# EasyEDA Pro project esp32-1602.eprj

# Schematic Schematic1
Board Name: Board1; Create Date: 2025-05-10; Page Name: P1; Project Name: thermostat; Schematic Name: Schematic1; Update Date: 2025-05-10; Company: EasyEDA.com; Page Size: A4; Version: V1.0
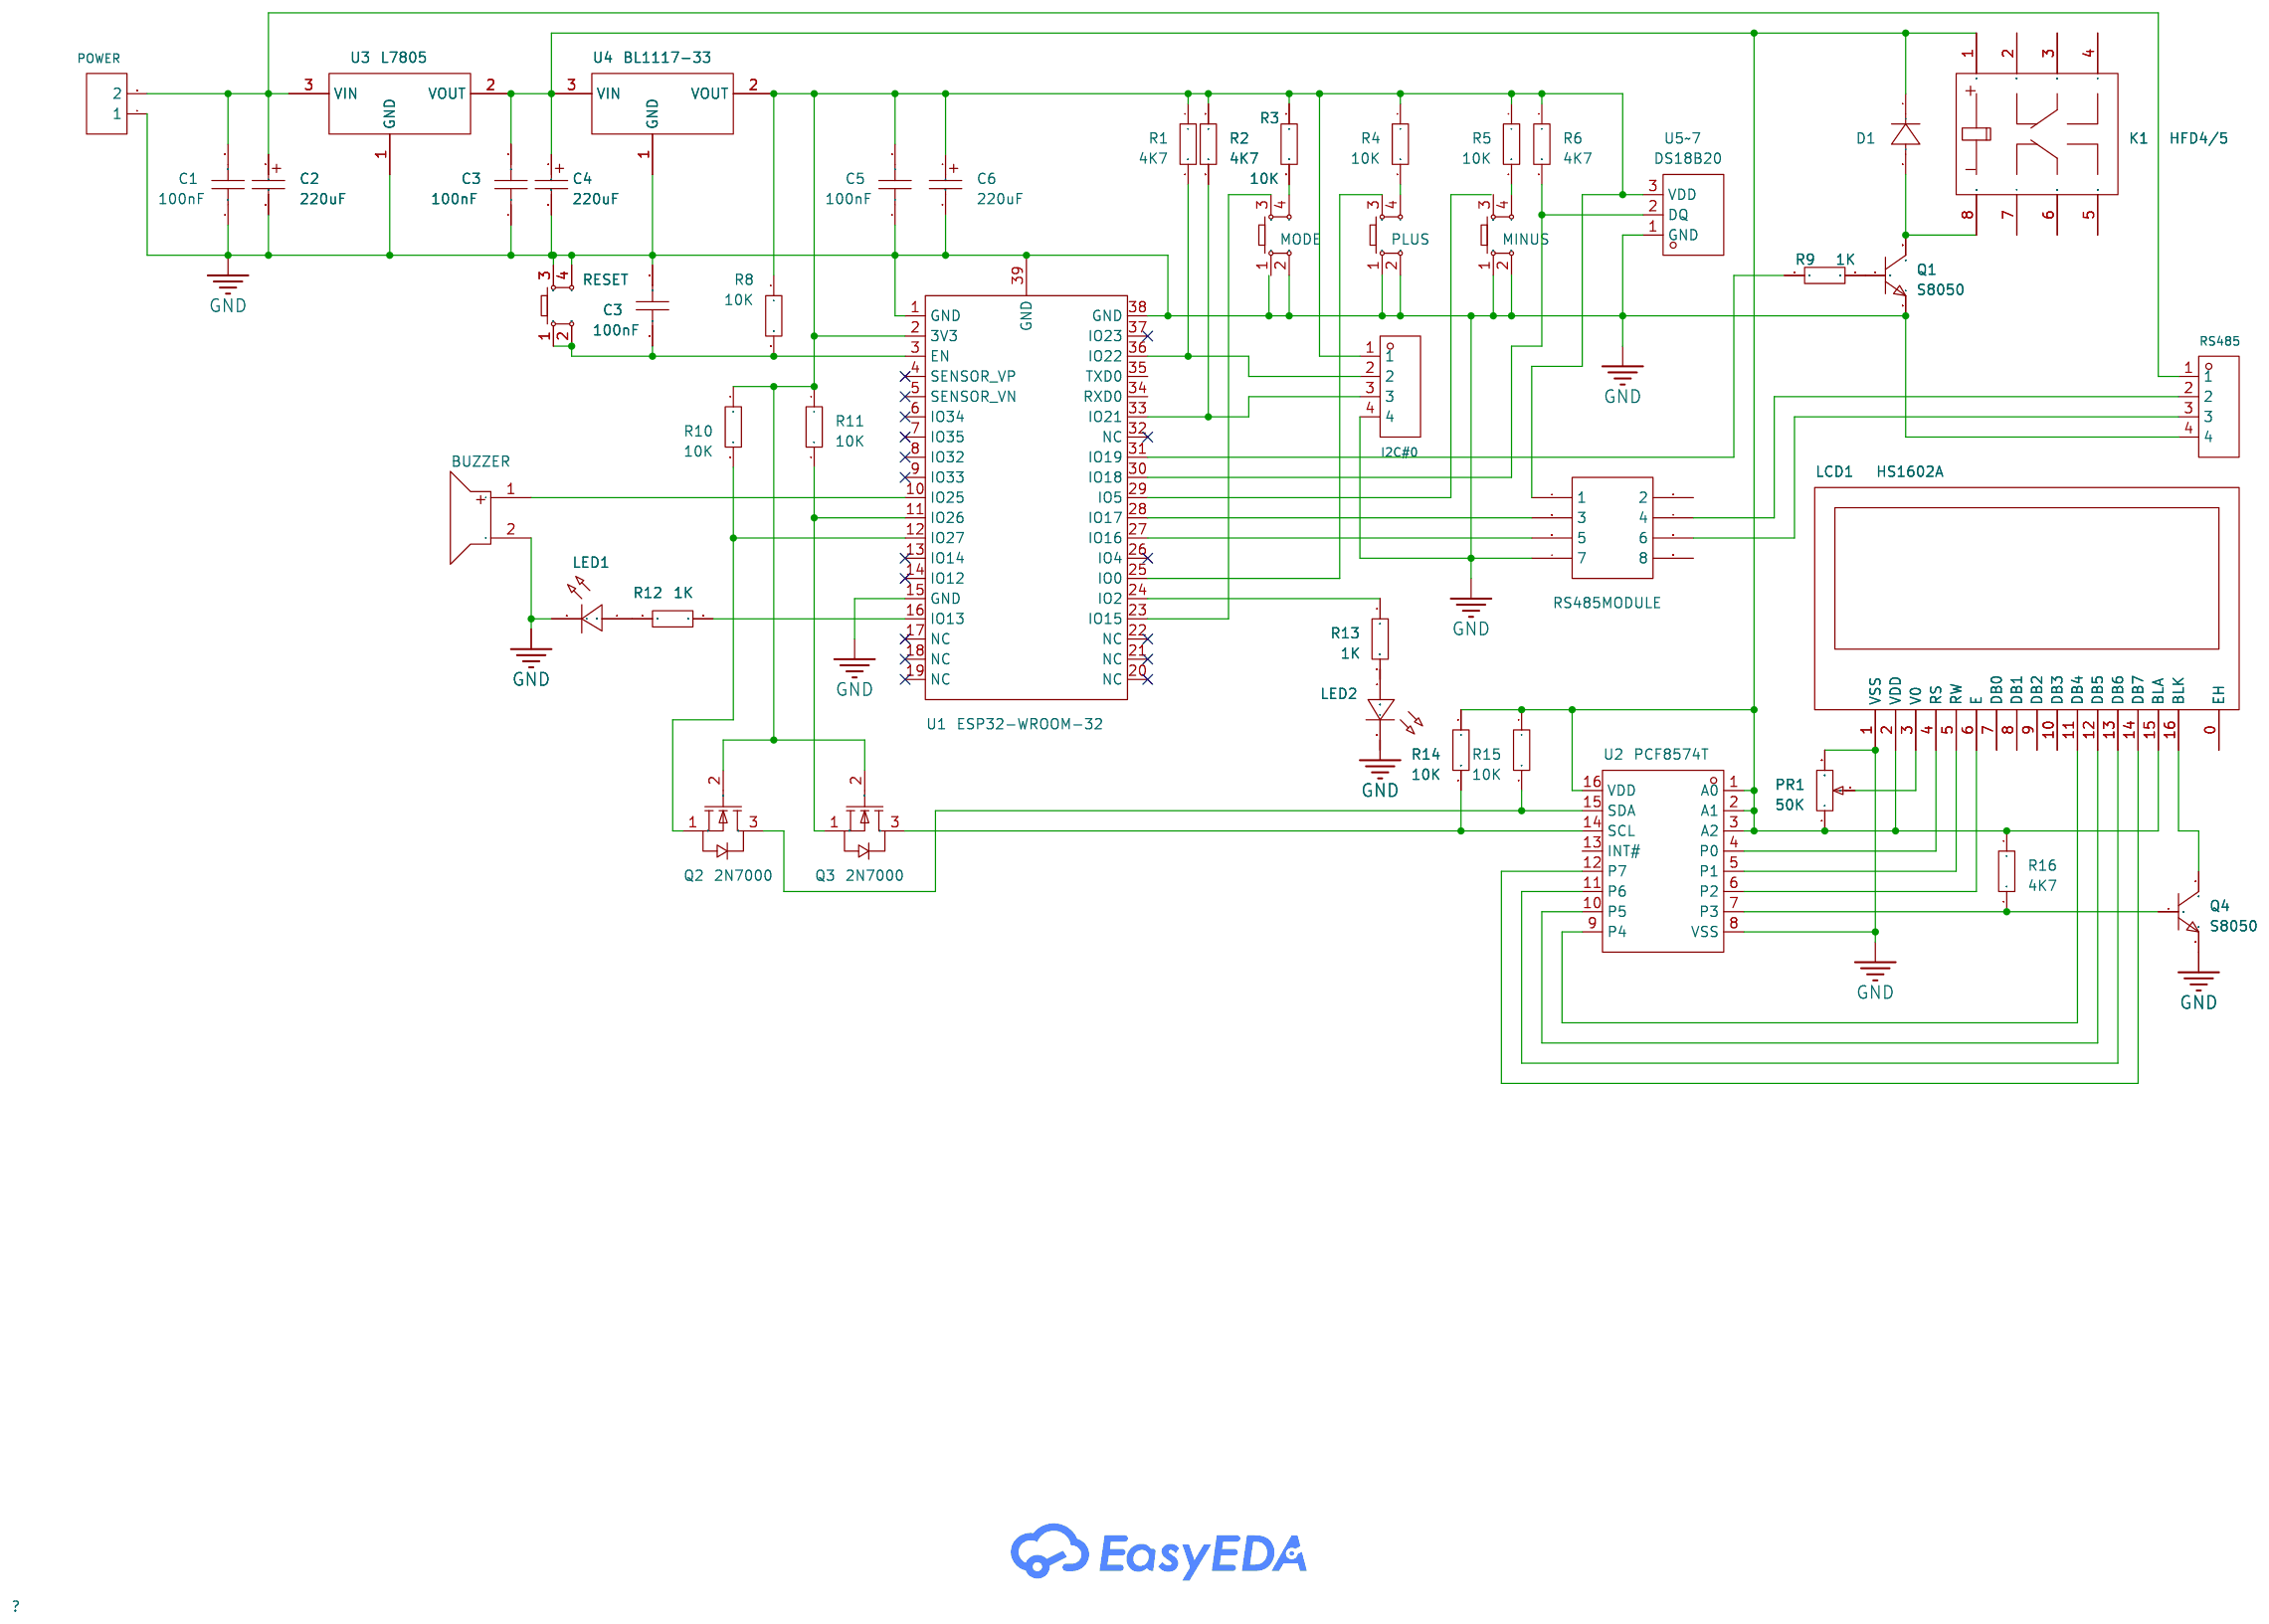
[diagram p0: schematic sheet]

## Parts
BUZZER  2.4kHz  [BUZ-TH_BD12.0-P7.60-D0.6-FD]
C1  100nF  [C0201]
C2  220uF  [CAP-SMD_BD3.0-L3.3-W3.3-RD]
C3  100nF  [C0201]
C3#2  100nF  [C0201]
C4  220uF  [CAP-SMD_BD3.0-L3.3-W3.3-RD]
C5  100nF  [C0201]
C6  220uF  [CAP-SMD_BD3.0-L3.3-W3.3-RD]
D1  -  [DO-41_BD2.4-L4.7-P8.70-D0.9-RD]
I2C#0  -  [HDR-TH_4P-P2.54-V-F]
K1  HFD4/5  [RELAY-TH_HFDXXX]
LCD1  HS1602A  [LCD1602]
LED1  -  [LED-TH_BD3.0-P2.54-FD]
LED2  -  [LED-TH_BD3.0-P2.54-FD]
MINUS  -  [SW-SMD_4P-L6.0-W6.0-P4.50-LS9.0-2]
MODE  -  [SW-SMD_4P-L6.0-W6.0-P4.50-LS9.0-2]
PLUS  -  [SW-SMD_4P-L6.0-W6.0-P4.50-LS9.0-2]
POWER  -  [HDR-TH_2P-P2.54-V-F]
PR1  50K  [RES-ADJ-TH_3P-L9.5-W9.5-P2.54-BR-BS]
Q1  S8050  [SOT-23-3_L2.9-W1.3-P1.90-LS2.4-BR]
Q2  2N7000  [TO-92-3_L4.8-W3.7-P2.54-L]
Q3  2N7000  [TO-92-3_L4.8-W3.7-P2.54-L]
Q4  S8050  [SOT-23-3_L2.9-W1.3-P1.90-LS2.4-BR]
R1  4K7  [R0603]
R2  4K7  [R0603]
R3  10K  [R0603]
R4  10K  [R0603]
R5  10K  [R0603]
R6  4K7  [R0603]
R8  10K  [R0603]
R9  1K  [R0603]
R10  10K  [R0603]
R11  10K  [R0603]
R12  1K  [R0603]
R13  1K  [R0603]
R14  10K  [R0603]
R15  10K  [R0603]
R16  4K7  [R0603]
RESET  -  [SW-SMD_4P-L6.0-W6.0-P4.50-LS9.0-2]
RS485  -  [HDR-TH_4P-P2.54-V-F]
RS485MODULE  -  [HDR-TH_8P-P2.54-V-F-R2-C4-S2.54-1]
U1  ESP32-WROOM-32  [WIFI-SMD_ESP32-WROOM-32E]
U2  PCF8574T  [SOP-16_L10.3-W7.5-P1.27-LS10.4-BL]
U3  L7805  [TO-252-2_L6.6-W6.1-P4.57-LS9.9-TL-CW]
U4  BL1117-33  [TO-252-2_L6.6-W6.1-P4.57-LS9.9-TL-CW]
U5~7  DS18B20  [TO-92-3_L4.5-W3.5-P1.27-L]

## Library data of the parts
BUZZER = TMB12A03: LCSC Part Name: 有源电磁式蜂鸣器; Supplier Part: C781859; Manufacturer: YUEXIN(悦馨); Supplier Footprint: 插件,D=12mm; JLCPCB Part Class: Extended Part; Datasheet: https://atta.szlcsc.com/upload/public/pdf/source/20200927/C781859_CEC7B7F6A9D62F380D126441DF0F265C.pdf; Supplier: LCSC; Driver Circuitry: Active (Built-in Driver Circuit); Technology: Electromagnetic Type; Voltage - Supply: 4V~6V; Current Consumption: 30mA; Sound Pressure Level(SPL): 88dB; Diameter(φD): 12mm; Height: 9.5mm; Operating Temperature: -30℃~+85℃
C1 C3 C3#2 C5 = CAP_0201: Supplier Footprint: 0201
C2 C4 C6 = C_Ele_SMD_3x5.4mm: Supplier Footprint: SMD,3x5.4mm
D1 = 1N4007: Supplier Footprint: DO-41
I2C#0 RS485 = HDR-F_2.54_1x4P: Supplier Footprint: Through
K1 = HFD4/5: LCSC Part Name: 超小型5V继电器 双刀双掷; Supplier Part: C23510; Manufacturer: HF(宏发); Supplier Footprint: DIP,6.5x10mm; JLCPCB Part Class: Extended Part; Datasheet: https://atta.szlcsc.com/upload/public/pdf/source/20190729/C390665_9F7E181D3821B0A9B6A96379D32A4DEC.pdf; Supplier: LCSC; Coil Voltage: 5V; Contact Form: Two Sets of Conversion: 2C (DPDT-Conversion); Number of Pins: 8; Contact Rating: 1A@30VDC；300mA@125VAC; Switching Voltage(Max): 250V@AC；220V@DC; Contact Material: AgNi+Gold plating; Coil Rated Power: 140mW; Coil Resistance: 178Ω; Switching Current(Max): 2A; Operate Time: 3ms; Release Time: 3ms; Coil Type: Polarized - single coil; Contact Resistance: 100mΩ; Operating Temperature: -40℃~+85℃
LCD1 = HS1602A: LCSC Part Name: 2.0寸16*2单色字符字符液晶显示屏; Supplier Part: C5329588; Manufacturer: HS(汉昇); JLCPCB Part Class: Extended Part; Datasheet: https://atta.szlcsc.com/upload/public/pdf/source/20221212/35734F14DBB323F90DD8DBE1717CD9FD.pdf; Supplier: LCSC; Main Control Chip: SPLC780; Size: 2; Operating Temperature: -20℃~+70℃
LED1 LED2 = LED_TH-R_3mm: Supplier Footprint: Through
MINUS MODE PLUS RESET = Key_SMD_6x6x6.5: Supplier Footprint: SMD
POWER = HDR-F_2.54_1x2P: Supplier Footprint: Through
PR1 = R_3386P: Supplier Footprint: Through
Q1 Q4 = S8050_C2846756: LCSC Part Name: NPN 电流:500mA 耐压:25V; Supplier Part: C2846756; Manufacturer: UMW(友台半导体); Supplier Footprint: SOT-23; JLCPCB Part Class: Extended Part; Datasheet: https://atta.szlcsc.com/upload/public/pdf/source/20231109/CC2BCCE3E0BB53E872CD60D7C979DAE8.pdf; Supplier: LCSC; Collector Current (Ic): 500mA; Power Dissipation (Pd): 300mW; DC Current Gain (hFE@Ic,Vce): 120@50mA,1V; Transition Frequency (fT): 150MHz; Collector Cut-Off Current (Icbo): 100nA; Collector-Emitter Saturation Voltage (VCE(sat)@Ic,Ib): 600mV@500mA,50mA; Operating Temperature: -55℃~+150℃
Q2 Q3 = 2N7000-D74Z: LCSC Part Name: 1个N沟道 耐压:60V 电流:200mA; Supplier Part: C900717; Manufacturer: onsemi(安森美); Supplier Footprint: TO-92-3; JLCPCB Part Class: Extended Part; Datasheet: https://atta.szlcsc.com/upload/public/pdf/source/20210809/C900717_E0C96B00CF4E5BF84AE2BACE99F744A0.pdf; Supplier: LCSC; Type: 1 N-channel; Drain Source On Resistance (RDS(on)@Vgs,Id): 1.2Ω@10V,500mA; Gate Threshold Voltage (Vgs(th)@Id): 3V@1mA; Input Capacitance (Ciss@Vds): 50pF@25V; Reverse Transfer Capacitance (Crss@Vds): 5pF@25V; Operating Temperature: -55℃~+150℃
R1-R6 R8-R16 = Res_0603: Supplier Footprint: 0603
RS485MODULE = HDR-F-2.54_2x4: Supplier Footprint: Through
U1 = ESP32-WROOM-32E-N4: LCSC Part Name: 通用型Wi-Fi+BT+BLE MCU模组; Supplier Part: C701341; Manufacturer: ESPRESSIF(乐鑫); Supplier Footprint: SMD,18x25.5mm; JLCPCB Part Class: Extended Part; Datasheet: https://atta.szlcsc.com/upload/public/pdf/source/20220601/0020821B65DE5740BBACA5FACC5CF3B6.pdf; Supplier: LCSC
U2 = PCF8574T_C2832396: LCSC Part Name: 远程8位I2C总线I/O扩展器; Supplier Part: C2832396; Manufacturer: HGSEMI(华冠); Supplier Footprint: SOP-16-300mil; JLCPCB Part Class: Extended Part; Datasheet: https://atta.szlcsc.com/upload/public/pdf/source/20190611/C398075_1925312D8618E19C6137781D5B71A3CA.pdf; Supplier: LCSC; Interface: I2C; Number of I/O: 8; Interrupt Output: With Interrupt Output; Output Type: Leakage; Voltage - Supply: 2.5V~6V; Clock Frequency: 100kHz; Operating Temperature: -40℃~+85℃
U3 U4 = BL1117-33CY: LCSC Part Name: 输入12V 输出3.3V 1A; Supplier Part: C165080; Manufacturer: BL(上海贝岭); Supplier Footprint: TO-252-2(DPAK); JLCPCB Part Class: Extended Part; Datasheet: https://atta.szlcsc.com/upload/public/pdf/source/20180613/C194636_D3864D322BCB225C7C2160CC92E3DB8E.pdf; Supplier: LCSC; Output Type: Fixed; Voltage - Supply: 12V; Output Voltage: 3.3V; Output Current: 1A; Power Supply Rejection Ratio (PSRR): 60dB@(120Hz); Voltage Dropout: 1.5V@(1A); Features: 热关断(TSD)；Overcurrent Protection(OCP); Output Configuration: Positive electrode; Number of Outputs: 1
U5~7 = DS18B20_C5451632: LCSC Part Name: 温度-10℃~70℃ 精度±0.4℃ 电压2.5V~5.5V; Supplier Part: C5451632; Manufacturer: HXY MOSFET(华轩阳电子); Supplier Footprint: TO-92; JLCPCB Part Class: Extended Part; Datasheet: https://atta.szlcsc.com/upload/public/pdf/source/20230427/F43BF9FBC8AD29BCFCC811AFA154CBDD.pdf; Supplier: LCSC; Temperature Range: -10℃~70℃; Tolerance: ±0.4℃; Voltage - Supply: 2.5V~5.5V

## Nets
GND: BUZZER.2 C1.1 C2.2 C3.1 C3#2.2 C4.2 C5.1 C6.2 I2C#0.4 LCD1.1(VSS) LED1.2(A) LED2.2(A) MINUS.1 MINUS.2 MODE.2 PLUS.1 PLUS.2 POWER.1 PR1.3 Q1.2(E) Q4.2(E) RESET.3 RESET.4 RS485.4 RS485MODULE.7 U1.1(GND) U1.15(GND) U1.38(GND) U1.39(GND) U2.8(VSS) U3.1(GND) U4.1(GND) U5~7.1(GND)
Net-(BUZZER-1): BUZZER.1 U1.10(IO25)
Net-(C1-2): C1.2 C2.1 POWER.2 RS485.1 U3.3(VIN)
Net-(C3#2-1): C3#2.1 R8.2 RESET.1 RESET.2 U1.3(EN)
Net-(C3-2): C3.2 C4.1 D1.1(K) K1.1 LCD1.2(VDD) LCD1.15(BLA) PR1.1 R14.1 R15.1 R16.1 U2.1(A0) U2.2(A1) U2.3(A2) U2.16(VDD) U3.2(VOUT) U4.3(VIN)
Net-(C5-2): C5.2 C6.1 I2C#0.1 Q2.2(G) Q3.2(G) R1.1 R2.1 R3.1 R4.1 R5.1 R6.1 R8.1 R10.1 R11.1 RS485MODULE.1 U1.2(3V3) U4.2(VOUT) U5~7.3(VDD)
Net-(D1-2): D1.2(A) K1.8 Q1.3(C)
Net-(I2C#0-2): I2C#0.2 R1.2 U1.36(IO22)
Net-(I2C#0-3): I2C#0.3 R2.2 U1.33(IO21)
Net-(LCD1-3): LCD1.3(V0) PR1.2
Net-(LCD1-4): LCD1.4(RS) U2.4(P0)
Net-(LCD1-5): LCD1.5(RW) U2.5(P1)
Net-(LCD1-6): LCD1.6(E) U2.6(P2)
Net-(LCD1-11): LCD1.11(DB4) U2.9(P4)
Net-(LCD1-12): LCD1.12(DB5) U2.10(P5)
Net-(LCD1-13): LCD1.13(DB6) U2.11(P6)
Net-(LCD1-14): LCD1.14(DB7) U2.12(P7)
Net-(LCD1-16): LCD1.16(BLK) Q4.3(C)
Net-(LED1-1): LED1.1(C) R12.1
Net-(LED2-1): LED2.1(C) R13.2
Net-(MINUS-4): MINUS.4 R5.2
Net-(MODE-3): MODE.3 U1.23(IO15)
Net-(MODE-4): MODE.4 R3.2
Net-(PLUS-3): PLUS.3 U1.25(IO0)
Net-(PLUS-4): PLUS.4 R4.2
Net-(Q1-1): Q1.1(B) R9.2
Net-(Q2-1): Q2.1(S) R10.2 U1.12(IO27)
Net-(Q2-3): Q2.3(D) R15.2 U2.15(SDA)
Net-(Q3-1): Q3.1(S) R11.2 U1.11(IO26)
Net-(Q3-3): Q3.3(D) R14.2 U2.14(SCL)
Net-(Q4-1): Q4.1(B) R16.2 U2.7(P3)
Net-(R6-2): R6.2 U1.30(IO18) U5~7.2(DQ)
Net-(R9-1): R9.1 U1.31(IO19)
Net-(R12-2): R12.2 U1.16(IO13)
Net-(R13-1): R13.1 U1.24(IO2)
Net-(RS485-2): RS485.2 RS485MODULE.4
Net-(RS485-3): RS485.3 RS485MODULE.6
Net-(RS485MODULE-3): RS485MODULE.3 U1.28(IO17)
Net-(RS485MODULE-5): RS485MODULE.5 U1.27(IO16)

Not connected (* = marked no-connect by the designer): K1 2 3 4 5 6 7; LCD1 0(EH) 7(DB0) 8(DB1) 9(DB2) 10(DB3); MINUS 3; MODE 1; RS485MODULE 2 8; U1 4(SENSOR_VP)* 5(SENSOR_VN)* 6(IO34)* 7(IO35)* 8(IO32)* 9(IO33)* 13(IO14)* 14(IO12)* 17(NC)* 18(NC)* 19(NC)* 20(NC)* 21(NC)* 22(NC)* 26(IO4)* 29(IO5) 32(NC)* 34(RXD0) 35(TXD0) 37(IO23)*; U2 13(INT#)

# Schematic Schematic2
Board Name: Board2; Create Date: 2025-05-11; Page Name: P1; Project Name: thermostat; Schematic Name: Schematic2; Update Date: 2025-05-15; Page Size: A4; Version: V1.0
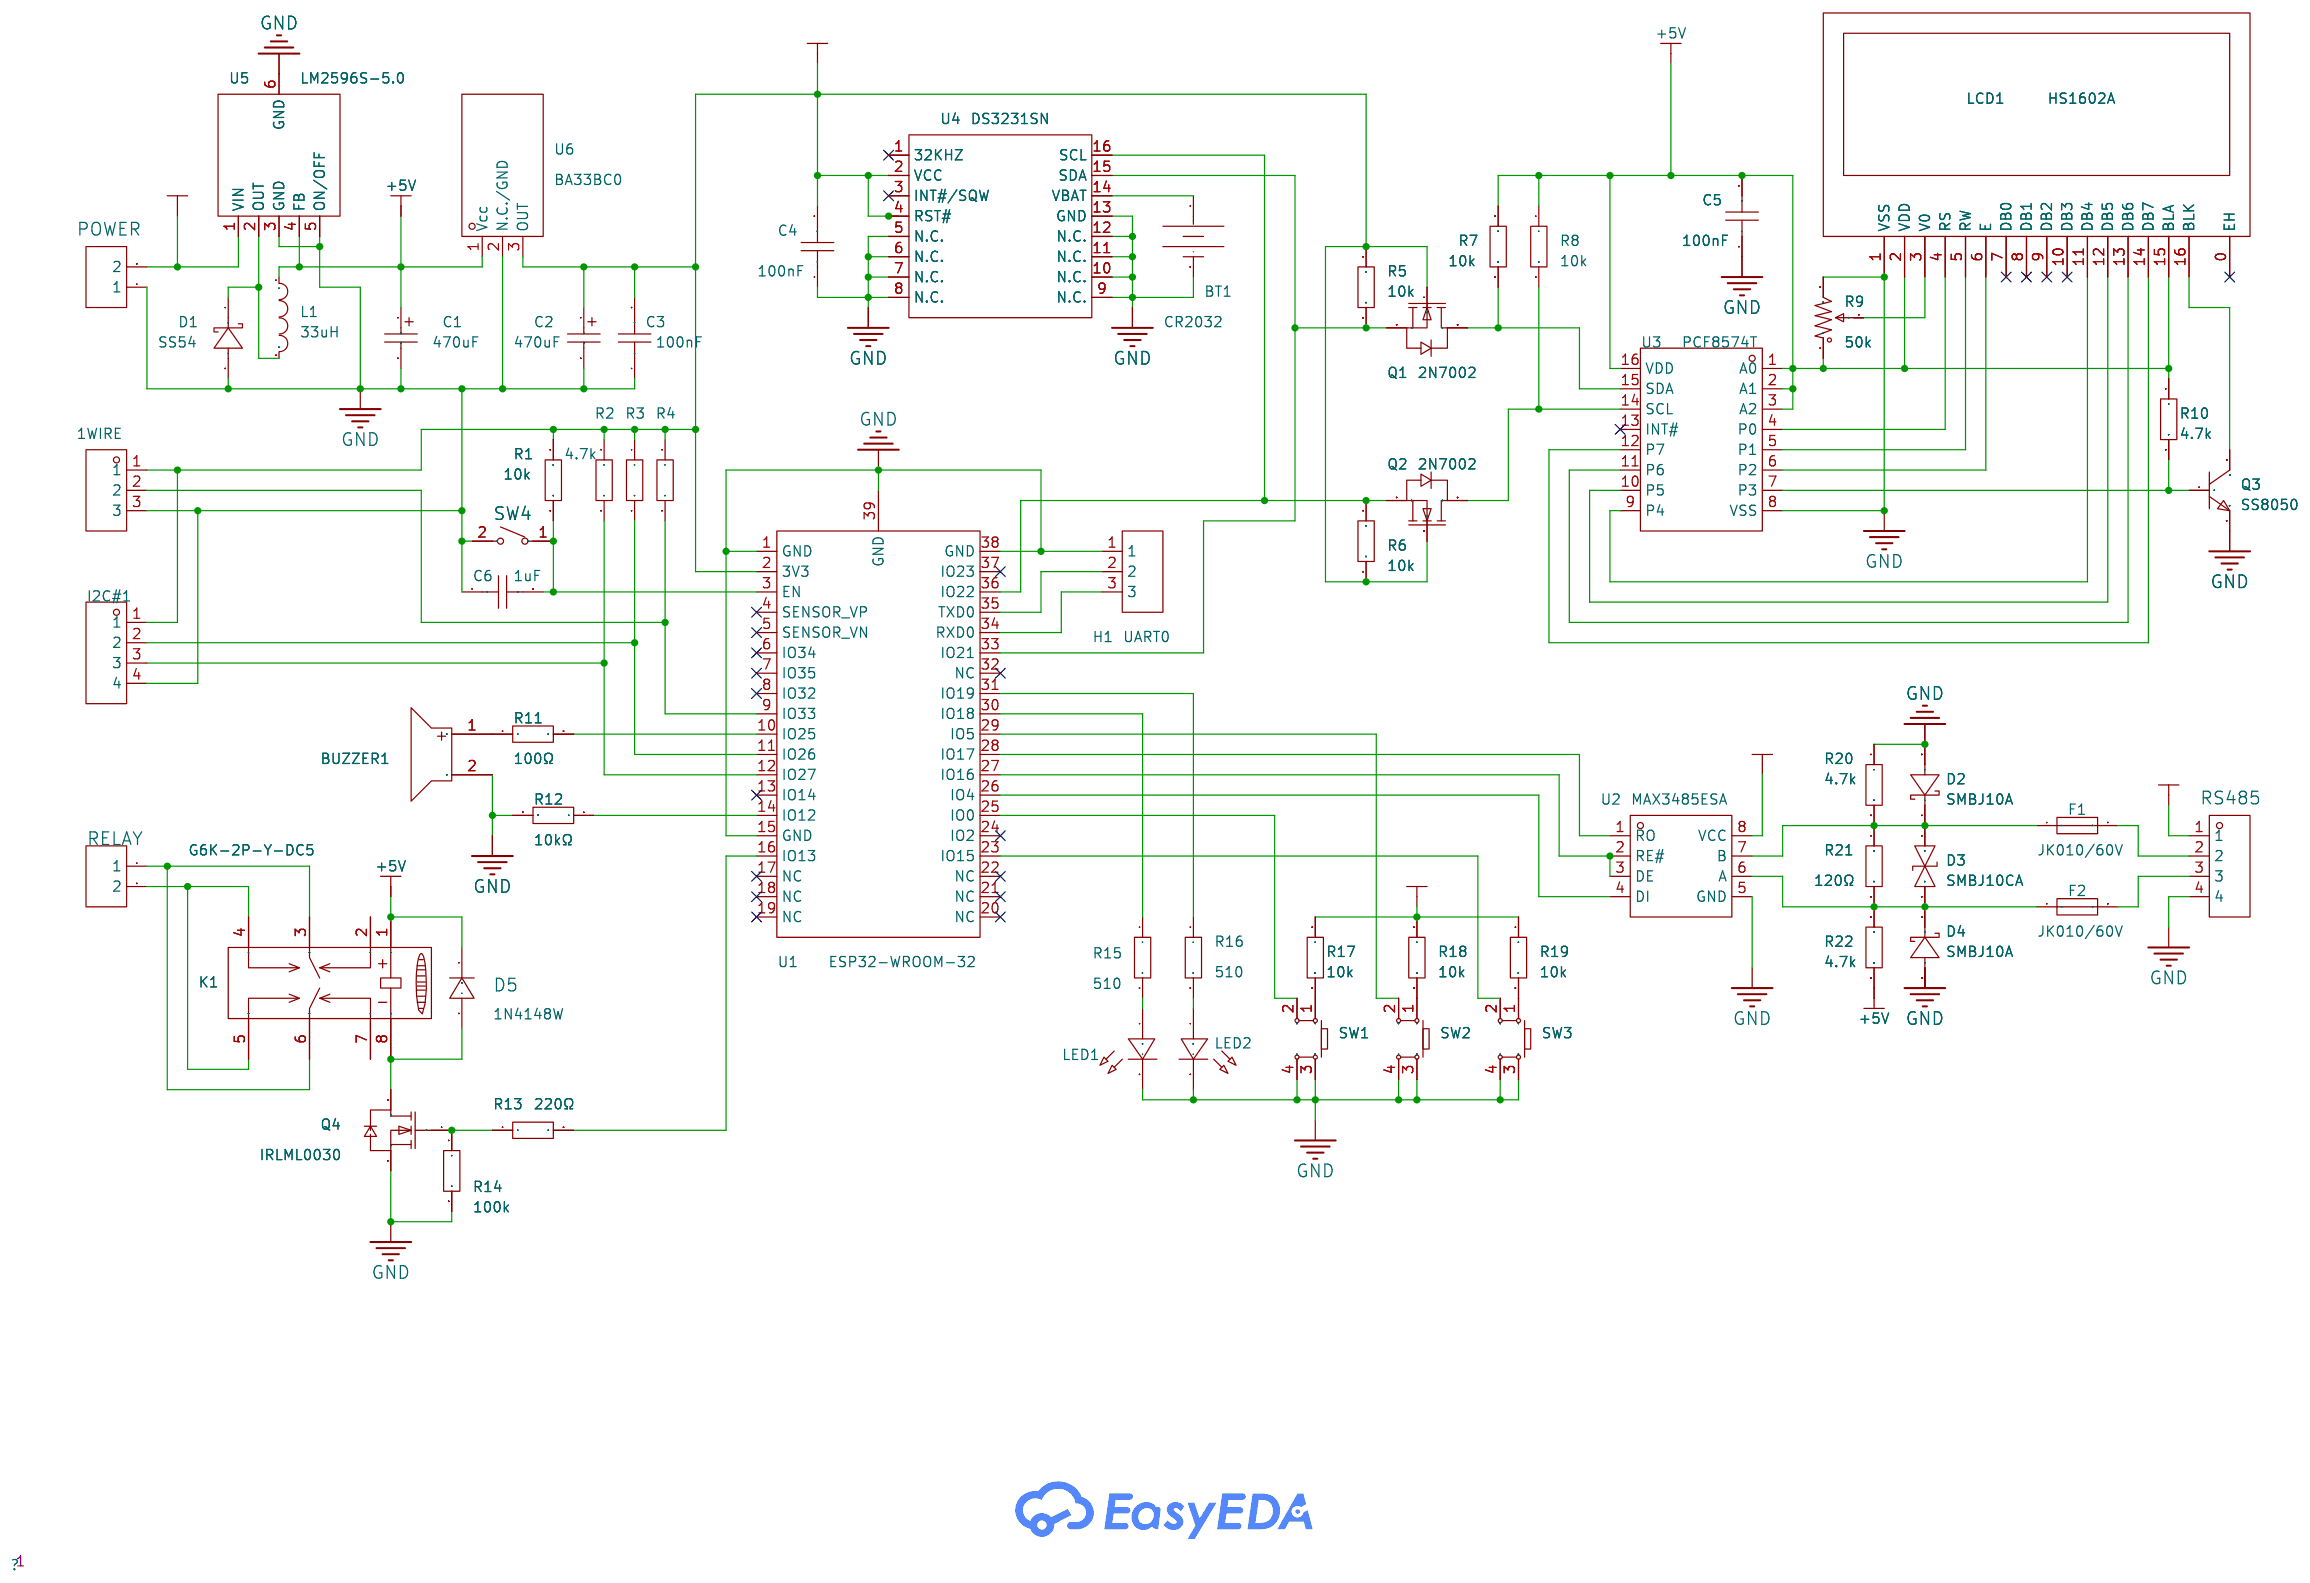
[diagram p1: schematic sheet]

## Parts
1WIRE  -  [HDR-TH_3P-P2.54-V-M]
BT1  CR2032  [BAT-TH_AAA-BAT-029-K01]
BUZZER1  2.4kHz  [BUZ-TH_BD12.0-P7.60-D0.6-FD]
C1  470uF  [CAP-SMD_BD4.0-L4.3-W4.3-FD]
C2  470uF  [CAP-SMD_BD4.0-L4.3-W4.3-FD]
C3  100nF  [C0805]
C4  100nF  [C0805]
C5  100nF  [C0805]
C6  1uF  [C0805]
D1  SS54  [SMA_L4.3-W2.6-LS5.0-RD]
D2  SMBJ10A  [SMB_L4.4-W3.6-LS5.3-RD]
D3  SMBJ10CA  [SMB_L4.3-W3.6-LS5.4-BI]
D4  SMBJ10A  [SMB_L4.4-W3.6-LS5.3-RD]
D5  1N4148W  [SOD-123_L2.8-W1.8-LS3.7-RD]
F1  JK010/60V  [F1206]
F2  JK010/60V  [F1206]
H1  UART0  [HDR-TH_3P-P2.54-V-M]
I2C#1  -  [HDR-TH_4P-P2.54-V-M]
K1  G6K-2P-Y-DC5  [RELAY-TH_G6K-2P-Y]
L1  33uH  [L1206]
LCD1  HS1602A  [LCD1602]
LED1  -  [LED-TH_BD3.0-P2.54-FD]
LED2  -  [LED-TH_BD3.0-P2.54-FD]
POWER  -  [HDR-TH_2P-P2.54-V-F]
Q1  2N7002  [SOT-23-3_L2.9-W1.3-P1.90-LS2.4-BR]
Q2  2N7002  [SOT-23-3_L2.9-W1.3-P1.90-LS2.4-BR]
Q3  SS8050  [SOT-23-3_L2.9-W1.6-P1.90-LS2.8-BR]
Q4  IRLML0030  [SOT-23-3_L2.9-W1.3-P1.90-LS2.4-BR]
R1  10k  [R0805]
R2  4.7k  [R0805]
R3  4.7kΩ  [R0805]
R4  4.7kΩ  [R0805]
R5  10k  [R0805]
R6  10k  [R0805]
R7  10k  [R0805]
R8  10k  [R0805]
R9  50k  [RES-ADJ-TH_3362P]
R10  4.7k  [R0805]
R11  100Ω  [R1206]
R12  10kΩ  [R0805]
R13  220Ω  [R0805]
R14  100k  [R0805]
R15  510  [R0603]
R16  510  [R0603]
R17  10k  [R0805]
R18  10k  [R0805]
R19  10k  [R0805]
R20  4.7k  [R0805]
R21  120Ω  [R0805]
R22  4.7k  [R0805]
RELAY  -  [HDR-TH_2P-P2.54-V-F]
RS485  -  [HDR-TH_4P-P2.54-V-F]
SW1  -  [KEY-TH_4P-L6.0-W6.0-P3.90-LS6.5]
SW2  -  [KEY-TH_4P-L6.0-W6.0-P3.90-LS6.5]
SW3  -  [KEY-TH_4P-L6.0-W6.0-P3.90-LS6.5]
SW4  TS-1088C-02026  [SW-SMD_L4.0-W2.9-P4.15-EH]
U1  ESP32-WROOM-32  [WIFI-SMD_ESP32-WROOM-32E]
U2  MAX3485ESA  [SOP-8_L4.9-W3.9-P1.27-LS6.0-BL]
U3  PCF8574T  [SOP-16_L10.3-W7.5-P1.27-LS10.4-BL]
U4  DS3231SN  [SOIC-16_L10.3-W7.5-P1.27-LS10.3-BL]
U5  LM2596S-5.0  [TO-263-5_L10.2-W8.6-P1.70-LS14.4-BR]
U6  BA33BC0  [TO-252-3_L6.5-W5.5-P4.6-LS9.5-BL]

## Library data of the parts
1WIRE = HDR-M_2.54_1x3P: Supplier Footprint: Through
BT1 = AAA-BAT-029-K01: LCSC Part Name: 电池底座 适用电池:CR2032; Supplier Part: C962133; Manufacturer: LOTES(嘉澤端子); Supplier Footprint: 插件; JLCPCB Part Class: Extended Part; Datasheet: https://atta.szlcsc.com/upload/public/pdf/source/20201125/C962133_A2AAB0DFBD1627795CE0764F8252A2CA.pdf; Supplier: LCSC; Connector Type: Battery base
BUZZER1 = TMB12A03: LCSC Part Name: 有源电磁式蜂鸣器; Supplier Part: C781859; Manufacturer: YUEXIN(悦馨); Supplier Footprint: 插件,D=12mm; JLCPCB Part Class: Extended Part; Datasheet: https://atta.szlcsc.com/upload/public/pdf/source/20200927/C781859_CEC7B7F6A9D62F380D126441DF0F265C.pdf; Supplier: LCSC; Driver Circuitry: Active (Built-in Driver Circuit); Technology: Electromagnetic Type; Voltage - Supply: 4V~6V; Current Consumption: 30mA; Sound Pressure Level(SPL): 88dB; Diameter(φD): 12mm; Height: 9.5mm; Operating Temperature: -30℃~+85℃
C1 C2 = C_Ele_SMD_4x5.5mm: Supplier Footprint: SMD,4x5.5mm
C3-C6 = CAP_0805: Supplier Footprint: 0805
D1 = SS54_C3014014: LCSC Part Name: 电压:40V 电流:5A; Supplier Part: C3014014; Manufacturer: FOSAN(富信); Supplier Footprint: SMA; JLCPCB Part Class: Extended Part; Datasheet: https://atta.szlcsc.com/upload/public/pdf/source/20220517/CBC79A97D010A01380C4BBCDD978B992.pdf; Supplier: LCSC; Voltage - Forward(Vf@If): 550mV@5A; Voltage - DC Reverse(Vr): 40V; Current - Rectified: 5A; Reverse Leakage Current (Ir): 100uA@40V
D2 D4 = SMBJ10A_C7495257: LCSC Part Name: TVS 10V截止 35.29A峰值脉冲; Supplier Part: C7495257; Manufacturer: HXY MOSFET(华轩阳电子); Supplier Footprint: SMB; JLCPCB Part Class: Extended Part; Datasheet: https://atta.szlcsc.com/upload/public/pdf/source/20241104/7F78F0D845527F55B84D3900C4CA12B9.pdf; Supplier: LCSC; Reverse Stand-Off Voltage (Vrwm): 10V; Clamping Voltage: 17V; Peak Pulse Current (Ipp): 35.3A; Voltage - Breakdown: 11.1V; Type: TVS
D3 = SMBJ10CA_C782434: Supplier Part: C782434; Manufacturer: SEMBO(深波); Supplier Footprint: SMB(DO-214AA); JLCPCB Part Class: Extended Part; Datasheet: https://atta.szlcsc.com/upload/public/pdf/source/20200914/C782420_BB0DBCD40A47EBCD5666F735198E6B58.pdf; Supplier: LCSC; Reverse Stand-Off Voltage (Vrwm): 10V; Maximum Clamping Voltage: 17V; Peak Pulse Current (Ipp): 35.3A; Breakdown Voltage: 11.1V; Reverse Leakage Current (Ir): 5uA; Type: TVS
D5 = 1N4148W_C176288: LCSC Part Name: 电压:75V 电流:150mA; Supplier Part: C176288; Manufacturer: SMC(桑德斯); Supplier Footprint: SOD-123; JLCPCB Part Class: Extended Part; Datasheet: https://atta.szlcsc.com/upload/public/pdf/source/20180307/C176288_15203877704491402065.pdf; Supplier: LCSC; Forward Voltage (Vf@If): 1.25V@150mA; Reverse Leakage Current: 2.5uA@75V; Operating Temperature: -55℃~+125℃@(Tj)
F1 F2 = JK-nSMD010/60V: LCSC Part Name: 100mA 60V; Supplier Part: C2830236; Manufacturer: JK(金科); Supplier Footprint: 1206; JLCPCB Part Class: Extended Part; Datasheet: https://atta.szlcsc.com/upload/public/pdf/source/20210427/C2830251_B9511B640A50AD6A91174E2DDDD254CA.pdf; Supplier: LCSC; Voltage - Max: 60V; Current - Max: 100A; Hold Current: 100mA; Trip Current: 250mA; Resistance - Initial (Ri) (Min): 1.6Ω; Resistance - Post Trip (R1) (Max): 15Ω; Time to Trip(Max): 1s; Operating Temperature: -40℃~+85℃
H1 = PZ254V-11-03P: LCSC Part Name: 1x3P 间距:2.54mm 方针 直插; Supplier Part: C2937625; Manufacturer: XFCN(兴飞); Supplier Footprint: 插件,P=2.54mm; JLCPCB Part Class: Extended Part; Datasheet: https://atta.szlcsc.com/upload/public/pdf/source/20200309/C492402_8335C3D49C4E4C618838D59BB1D024C1.pdf; Supplier: LCSC; Pin Structure: 1x3P; Pitch: 2.54mm; Circluar Pins/Square Pins: Policy; Mounting Type: Straight; Number of Rows: Single Row; Number of Pins: 3P; Current Rating: 3A; Voltage Rating (Max): 250V; Length of Mating Pin: 6mm; Insulation Height: 2.5mm; Length of End Connection Pin: 3mm; Operating Temperature: -40℃~+105℃; Color: Black
I2C#1 = HDR-M_2.54_1x4P: Supplier Footprint: Through
K1 = G6K-2P-Y-DC5: Supplier Part: C80087; Manufacturer: OMRON(欧姆龙); Supplier Footprint: DIP,6.5x10mm; JLCPCB Part Class: Extended Part; Datasheet: https://atta.szlcsc.com/upload/public/pdf/source/20220125/C1876770_53E5491D4B68F29C4BBD8118E9BAE0E8.pdf; Supplier: LCSC; Coil Voltage: 5V; Contact Form: 两组转换:2C(DPDT-转换); Maximum Switching Voltage: 125V@AC；60V@DC; Contact Material: silver+Gold plating; Maximum Switching Current: 1A; Operate Time: 3ms; Release Time: 3ms; Operating Temperature: -40℃~+70℃
L1 = L_1206
LCD1 = HS1602A: LCSC Part Name: 2.0寸16*2单色字符字符液晶显示屏; Supplier Part: C5329588; Manufacturer: HS(汉昇); JLCPCB Part Class: Extended Part; Datasheet: https://atta.szlcsc.com/upload/public/pdf/source/20221212/35734F14DBB323F90DD8DBE1717CD9FD.pdf; Supplier: LCSC; Main Control Chip: SPLC780; Size: 2; Operating Temperature: -20℃~+70℃
LED1 LED2 = LED_TH-R_3mm: Supplier Footprint: Through
POWER RELAY = HDR-F_2.54_1x2P: Supplier Footprint: Through
Q1 Q2 = 2N7002_C2836920: LCSC Part Name: N沟道增强型MOSFET,电流:115mA,耐压:60V; Supplier Part: C2836920; Manufacturer: Leiditech(雷卯电子); Supplier Footprint: SOT-23; JLCPCB Part Class: Extended Part; Datasheet: https://atta.szlcsc.com/upload/public/pdf/source/20210531/C2836920_C542D843AD98582FE73B990216FCB445.pdf; Supplier: LCSC; Type: 1 N-channel; Drain to Source Voltage: 60V; Current - Continuous Drain(Id): 115mA; RDS(on): 7Ω@5V,50mA; Pd - Power Dissipation: 225mW; Gate Threshold Voltage (Vgs(th)@Id): 2.5V; Input Capacitance(Ciss@Vds): 50pF@25V; Reverse Transfer Capacitance (Crss@Vds): 5pF@25V; Operating Temperature: -55℃~+150℃
Q3 = SS8050_C111765: LCSC Part Name: NPN 电流:1.5A 耐压:25V hfe=200~350; Supplier Part: C111765; Manufacturer: SHIKUES(时科); Supplier Footprint: SOT-23; JLCPCB Part Class: Extended Part; Datasheet: https://atta.szlcsc.com/upload/public/pdf/source/20180622/C111765_FBF8DBD96D51278FE4358C508A276872.pdf; Supplier: LCSC; DC Current Gain (hFE@Ic,Vce): 200@100mA,1V; Transition Frequency (fT): 120MHz; Collector Cut-Off Current (Icbo): 100nA; Collector-Emitter Saturation Voltage (VCE(sat)@Ic,Ib): 500mV@800mA,80mA
Q4 = IRLML0030_C5364304: LCSC Part Name: N沟道MOSFET,电流:5.3A,耐压:30V; Supplier Part: C5364304; Manufacturer: Hottech(合科泰); Supplier Footprint: SOT-23; JLCPCB Part Class: Extended Part; Datasheet: https://atta.szlcsc.com/upload/public/pdf/source/20230301/6CB347F9880EB5AB4C7BACE2E84C0F57.pdf; Supplier: LCSC; Type: 1 N-channel; Drain to Source Voltage: 30V; Current - Continuous Drain(Id): 5.3A; RDS(on): 27mΩ@10V,5.2A; Gate Threshold Voltage (Vgs(th)@Id): 2.3V; Gate Charge(Qg): 2.6nC; Input Capacitance(Ciss@Vds): 382pF@15V; Reverse Transfer Capacitance (Crss@Vds): 39pF@15V; Operating Temperature: -55℃~+150℃
R1-R8 R10 R12-R14 R17-R22 = SCR0805J100K: Type:Thick Film Resistors Resistance: Tolerance:±5% Tolerance:±5% Power(Watts): Overload Voltage (Max): Operating Temperature Range:-55℃~+155℃ Operating Temperature Range:-55℃~+155℃; LCSC Part Name: 厚膜电阻 100kΩ ±5% 125mW; Supplier Part: C3017875; Manufacturer: VO(翔胜); Supplier Footprint: 0805; JLCPCB Part Class: Extended Part; Datasheet: https://atta.szlcsc.com/upload/public/pdf/source/20220513/247AF9639BA21CF93567DC289CCC6A22.pdf; Supplier: LCSC; Type: Thick Film Resistors; Tolerance: ±5%; Operating Temperature Range: -55℃~+155℃
R9 = 3362P-1-201: LCSC Part Name: 200Ω ±10%; Supplier Part: C125020; Manufacturer: BOCHEN(博晨); Supplier Footprint: 插件; JLCPCB Part Class: Extended Part; Datasheet: https://atta.szlcsc.com/upload/public/pdf/source/20171114/C125020_15106326796221117510.pdf; Supplier: LCSC; Tolerance: ±10%
R11 = Res_1206: Supplier Footprint: 1206
R15 R16 = Res_0603: Supplier Footprint: 0603
RS485 = HDR-F_2.54_1x4P: Supplier Footprint: Through
SW1-SW3 = Key_TH_6x6x4.5: Supplier Footprint: Through
SW4 = TS-1088C-02026: LCSC Part Name: 4*2.9*2mm 立贴 轻触开关; Supplier Part: C455278; Manufacturer: XUNPU(讯普); Supplier Footprint: SMD,3x4mm; JLCPCB Part Class: Extended Part; Datasheet: https://atta.szlcsc.com/upload/public/pdf/source/20191118/C455279_8016AD0A42E73A19E148640F82D71526.pdf; Supplier: LCSC; Circuit: SPST; Actuator Style: Round Button; Mounting Style: Brick nogging; Switch Length: 4mm; Switch Width: 2.9mm; Switch Height: 2mm; Contact Current: 50mA; Voltage Rating (DC): 12V
U1 = ESP32-WROOM-32E-N4: LCSC Part Name: 通用型Wi-Fi+BT+BLE MCU模组; Supplier Part: C701341; Manufacturer: ESPRESSIF(乐鑫); Supplier Footprint: SMD,18x25.5mm; JLCPCB Part Class: Extended Part; Datasheet: https://atta.szlcsc.com/upload/public/pdf/source/20220601/0020821B65DE5740BBACA5FACC5CF3B6.pdf; Supplier: LCSC
U2 = MAX3485ESA: LCSC Part Name: MAX3485ESA 3.3V供电半双工低功耗RS-485收发器; Supplier Part: C5279039; Manufacturer: TWGMC(台湾迪嘉); Supplier Footprint: SOP-8; JLCPCB Part Class: Extended Part; Datasheet: https://atta.szlcsc.com/upload/public/pdf/source/20221123/F3CFBFD8C21C7637E4DA947F784A8B93.pdf; Supplier: LCSC
U3 = PCF8574T_C2832396: LCSC Part Name: 远程8位I2C总线I/O扩展器; Supplier Part: C2832396; Manufacturer: HGSEMI(华冠); Supplier Footprint: SOP-16-300mil; JLCPCB Part Class: Extended Part; Datasheet: https://atta.szlcsc.com/upload/public/pdf/source/20190611/C398075_1925312D8618E19C6137781D5B71A3CA.pdf; Supplier: LCSC; Interface: I2C; Number of I/O: 8; Interrupt Output: With Interrupt Output; Output Type: Leakage; Voltage - Supply: 2.5V~6V; Clock Frequency: 100kHz; Operating Temperature: -40℃~+85℃
U4 = DS3231SN#: LCSC Part Name: 超高精度、I²C接口、集成RTC/TCXO/晶体; Supplier Part: C722469; Manufacturer: ADI(亚德诺)/MAXIM(美信); Supplier Footprint: SOIC-16-300mil; JLCPCB Part Class: Extended Part; Datasheet: https://atta.szlcsc.com/upload/public/pdf/source/20170713/C118524_1499918908819816807.pdf; Supplier: LCSC; Interface: I2C; Operating Voltage: 2.3V~5.5V; Operating Temperature: -40℃~+85℃
U5 = LM2596S-5.0_C19631823: Supplier Part: C19631823; Manufacturer: GR(国睿); Supplier Footprint: TO-263-5L; JLCPCB Part Class: Extended Part; Datasheet: https://atta.szlcsc.com/upload/public/pdf/source/20231222/C0C0FA2F27B9A861FEC2D8068E50B0DA.pdf; Supplier: LCSC; Function: Step-down type; Output Type: Fixed; Voltage - Supply: 4.5V~40V; Output Voltage: 5V; Output Current: 3A; Frequency - Switching: 170kHz; Operating Temperature: -20℃~+70℃; Synchronous Rectifier: No; Number of Outputs: 1; Topology: Step-down; Quiescent Current: 2mA; Switch tube (built-in/external): Built-in
U6 = BA33BC0FP-E2: Supplier Part: C2909274; Manufacturer: ROHM(罗姆); Supplier Footprint: TO-252; JLCPCB Part Class: Extended Part; Datasheet: https://atta.szlcsc.com/upload/public/pdf/source/20211022/618DE863901D29701FFD9AA6E16D3B64.pdf; Supplier: LCSC; Output Type: Fixed; Maximum Input Voltage: 16V; Output Voltage: 3.3V; Output Current: 1A; Power Supply Rejection Ratio (PSRR): 55dB@(120Hz); Feature: Thermal Protection(TSD)；Overcurrent Protection(OCP); Operating Temperature: -55℃~+150℃@(Ta); Output Polarity: Positive electrode; Number of Outputs: 1

## Nets
+3.3V: 1WIRE.1 C2.1 C3.2 C4.2 I2C#1.1 Q1.1(G) Q2.1(G) R1.1 R2.1 R3.1 R4.1 R5.1 R6.2 U1.2(3V3) U2.8(VCC) U4.2(VCC) U4.4(RST#) U6.3(OUT)
+3V3: R17.1 R18.1 R19.1
+5V: C1.1 C5.2 D5.1(C) K1.1 L1.1 LCD1.2(VDD) LCD1.15(BLA) R7.1 R8.1 R9.1 R10.1 R22.2 U3.1(A0) U3.2(A1) U3.3(A2) U3.16(VDD) U5.4(FB) U6.1(Vcc)
+12V: POWER.2 RS485.1 U5.1(VIN)
GND: 1WIRE.3 BT1.2(-) BUZZER1.2 C1.2 C2.2 C3.1 C4.1 C5.1 C6.1 D1.2(A) D2.2 D4.2 H1.1 I2C#1.4 LCD1.1(VSS) LED1.2(A) LED2.2(A) POWER.1 Q3.2 Q4.2(S) R9.3 R12.2 R14.2 R20.1 RS485.4 SW1.3 SW1.4 SW2.3 SW2.4 SW3.3 SW3.4 SW4.2 U1.1(GND) U1.15(GND) U1.38(GND) U1.39(GND) U2.5(GND) U3.8(VSS) U4.5(N.C.) U4.6(N.C.) U4.7(N.C.) U4.8(N.C.) U4.9(N.C.) U4.10(N.C.) U4.11(N.C.) U4.12(N.C.) U4.13(GND) U5.3(GND) U5.5(ON/OFF) U5.6(GND) U6.2(N.C./GND)
Net-(1WIRE-2): 1WIRE.2 R4.2 U1.9(IO33)
Net-(BT1-1): BT1.1(+) U4.14(VBAT)
Net-(BUZZER1-1): BUZZER1.1 R11.1
Net-(C6-2): C6.2 R1.2 SW4.1 U1.3(EN)
Net-(D1-1): D1.1(K) L1.2 U5.2(OUT)
Net-(D2-1): D2.1 D3.1 F1.1 R20.2 R21.1 U2.7(B)
Net-(D3-2): D3.2 D4.1 F2.1 R21.2 R22.1 U2.6(A)
Net-(D5-2): D5.2(A) K1.8 Q4.3(D)
Net-(F1-2): F1.2 RS485.2
Net-(F2-2): F2.2 RS485.3
Net-(H1-2): H1.2 U1.35(TXD0)
Net-(H1-3): H1.3 U1.34(RXD0)
Net-(I2C#1-2): I2C#1.2 R3.2 U1.11(IO26)
Net-(I2C#1-3): I2C#1.3 R2.2 U1.12(IO27)
Net-(K1-3): K1.3 K1.6 RELAY.1
Net-(K1-4): K1.4 K1.5 RELAY.2
Net-(LCD1-3): LCD1.3(V0) R9.2
Net-(LCD1-4): LCD1.4(RS) U3.4(P0)
Net-(LCD1-5): LCD1.5(RW) U3.5(P1)
Net-(LCD1-6): LCD1.6(E) U3.6(P2)
Net-(LCD1-11): LCD1.11(DB4) U3.9(P4)
Net-(LCD1-12): LCD1.12(DB5) U3.10(P5)
Net-(LCD1-13): LCD1.13(DB6) U3.11(P6)
Net-(LCD1-14): LCD1.14(DB7) U3.12(P7)
Net-(LCD1-16): LCD1.16(BLK) Q3.3
Net-(LED1-1): LED1.1(C) R15.2
Net-(LED2-1): LED2.1(C) R16.2
Net-(Q1-2): Q1.2(S) R5.2 U1.33(IO21) U4.15(SDA)
Net-(Q1-3): Q1.3(D) R7.2 U3.15(SDA)
Net-(Q2-2): Q2.2(S) R6.1 U1.36(IO22) U4.16(SCL)
Net-(Q2-3): Q2.3(D) R8.2 U3.14(SCL)
Net-(Q3-1): Q3.1 R10.2 U3.7(P3)
Net-(Q4-1): Q4.1(G) R13.1 R14.1
Net-(R11-2): R11.2 U1.10(IO25)
Net-(R12-1): R12.1 U1.14(IO12)
Net-(R13-2): R13.2 U1.16(IO13)
Net-(R15-1): R15.1 U1.30(IO18)
Net-(R16-1): R16.1 U1.31(IO19)
Net-(R17-2): R17.2 SW1.1
Net-(R18-2): R18.2 SW2.1
Net-(R19-2): R19.2 SW3.1
Net-(SW1-2): SW1.2 U1.25(IO0)
Net-(SW2-2): SW2.2 U1.29(IO5)
Net-(SW3-2): SW3.2 U1.23(IO15)
Net-(U1-26): U1.26(IO4) U2.4(DI)
Net-(U1-27): U1.27(IO16) U2.2(RE#) U2.3(DE)
Net-(U1-28): U1.28(IO17) U2.1(RO)

Not connected (* = marked no-connect by the designer): K1 2 7; LCD1 0(EH)* 7(DB0)* 8(DB1)* 9(DB2)* 10(DB3)*; U1 4(SENSOR_VP)* 5(SENSOR_VN)* 6(IO34)* 7(IO35)* 8(IO32)* 13(IO14)* 17(NC)* 18(NC)* 19(NC)* 20(NC)* 21(NC)* 22(NC)* 24(IO2)* 32(NC)* 37(IO23)*; U3 13(INT#)*; U4 1(32KHZ)* 3(INT#/SQW)*
